# EasyEDA Pro project ProProject_nRF52840无线键盘_2024-02-15.epro, schematic Schematic1

## Sheets
1 控制: Create Date: 2023-09-05; Page Name: 控制; Project Name: 键盘成品; Schematic Name: Schematic1; Update Date: 2023-09-09; Company: 嘉立创EDA; Page Size: A4; Version: V1.0
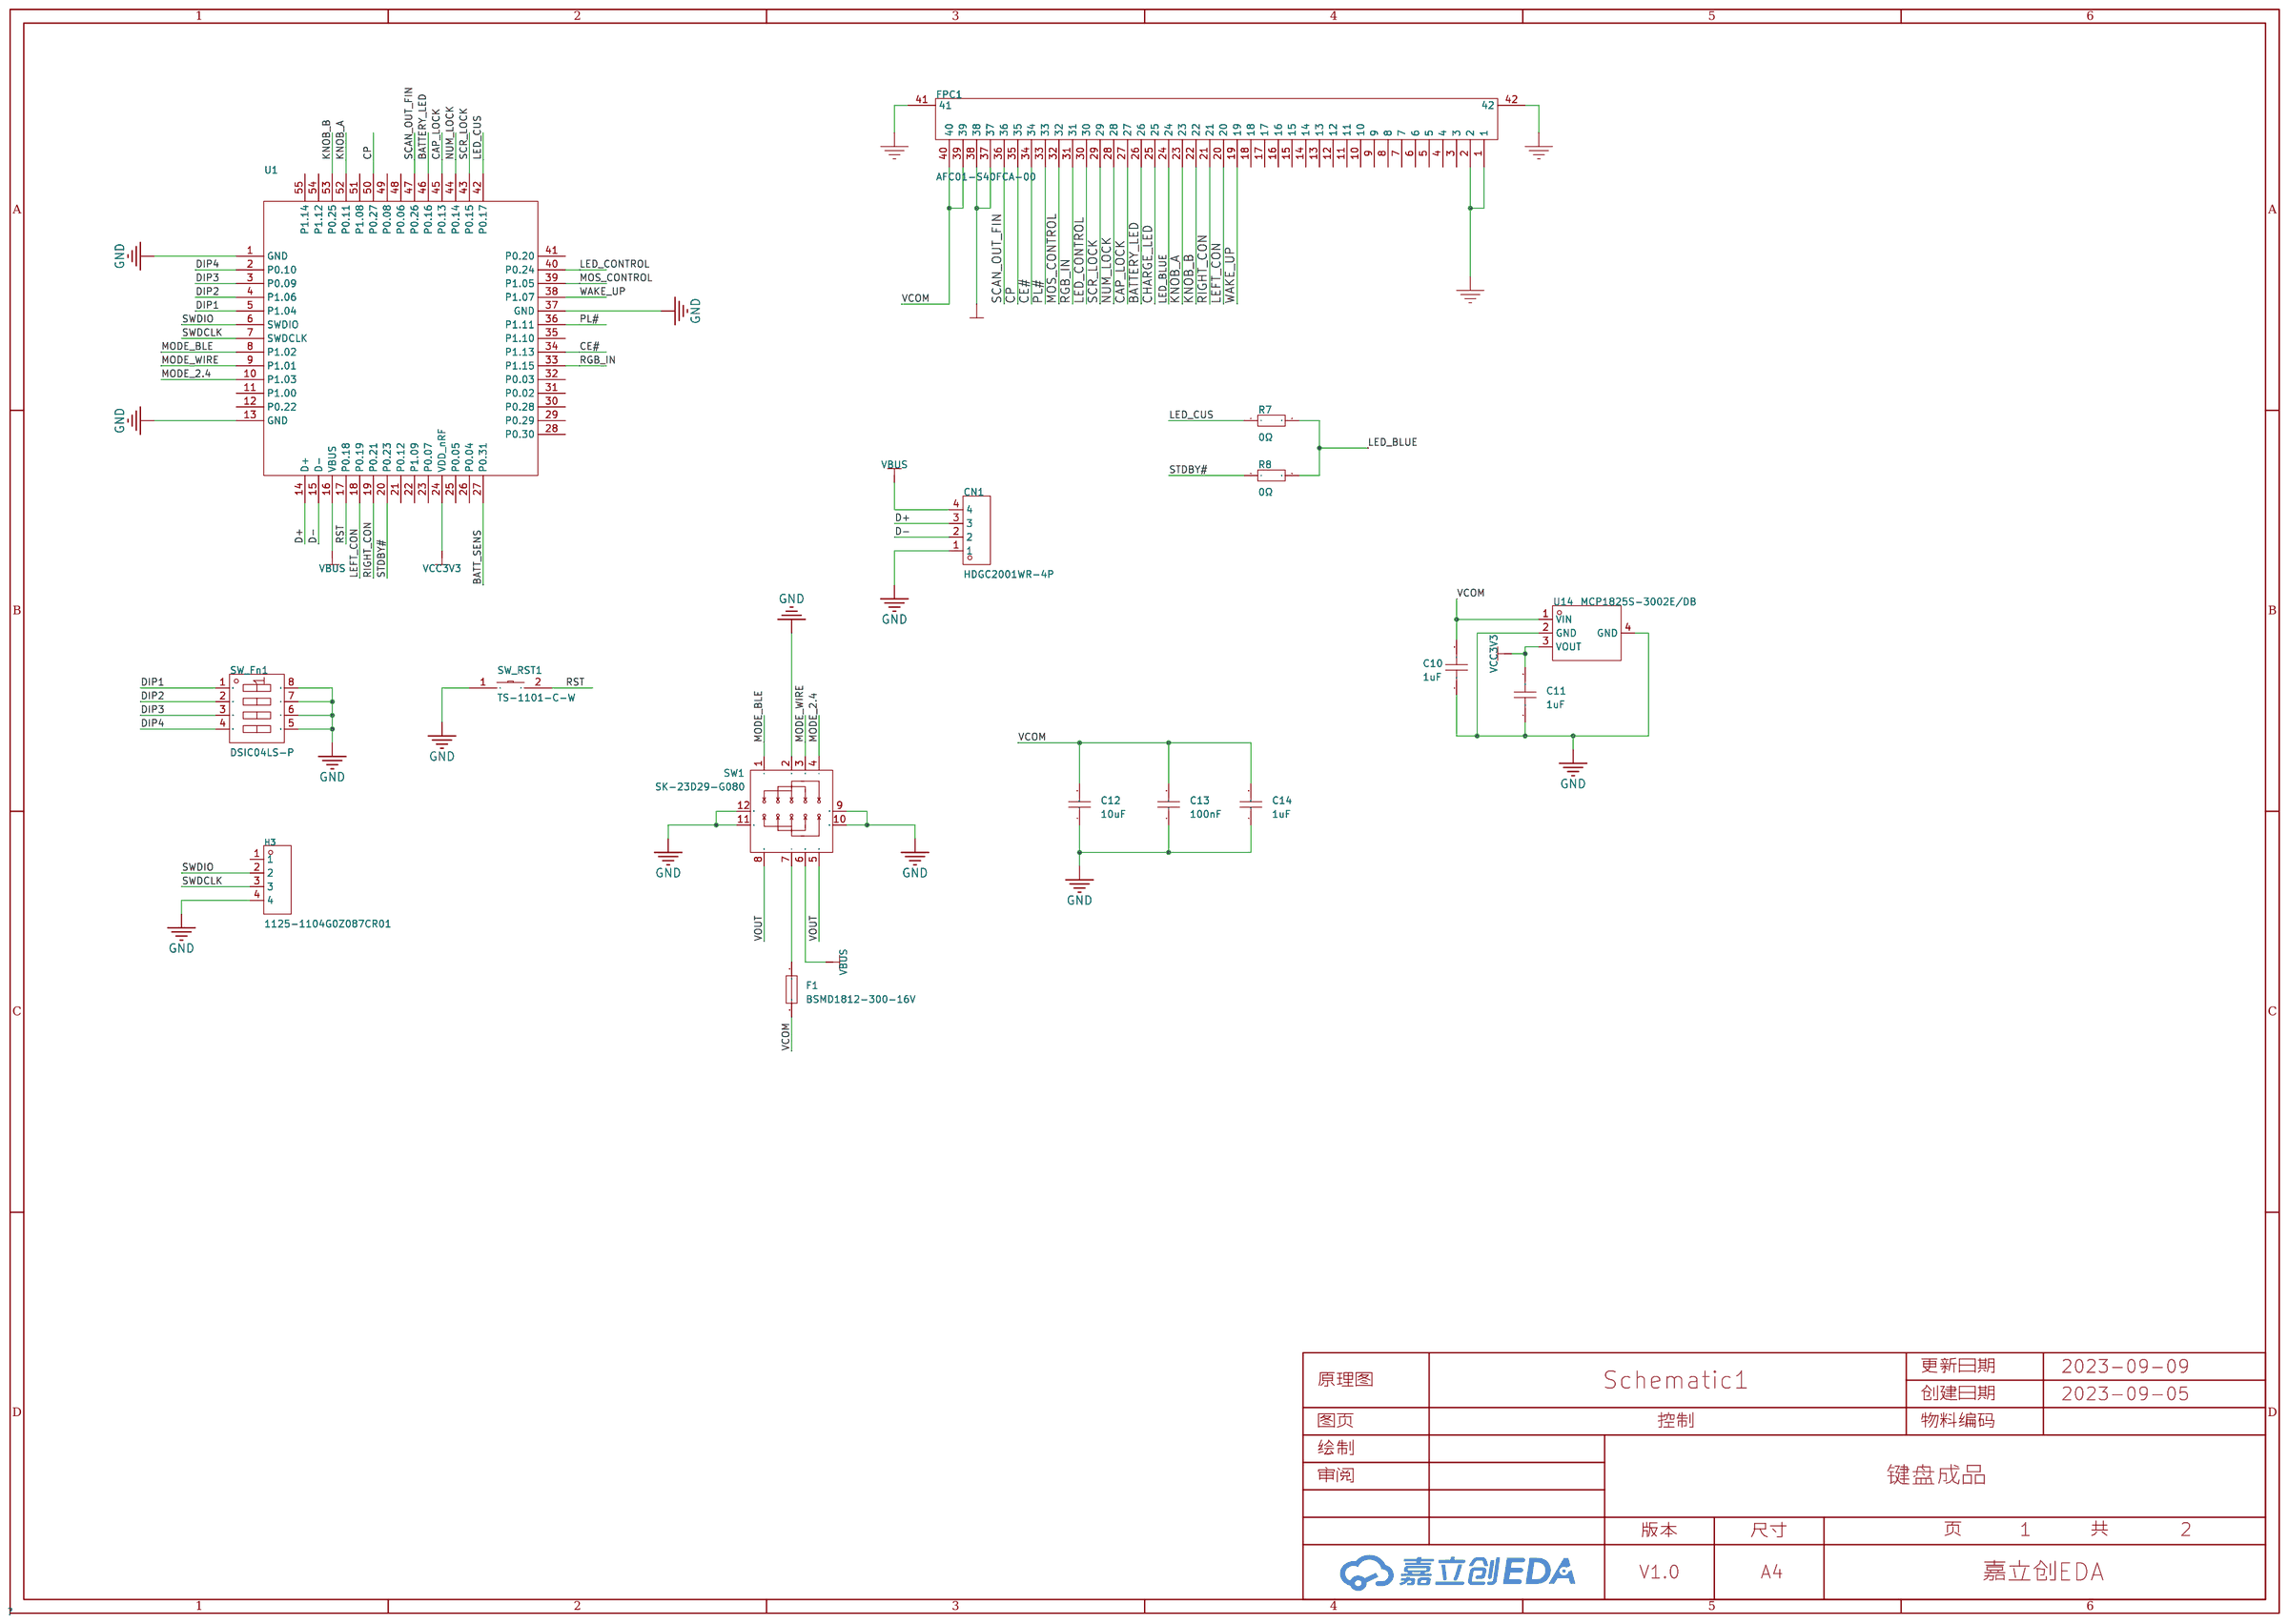
[diagram p9: 控制]
2 电源: Page Name: 电源; Update Date: 2023-09-05
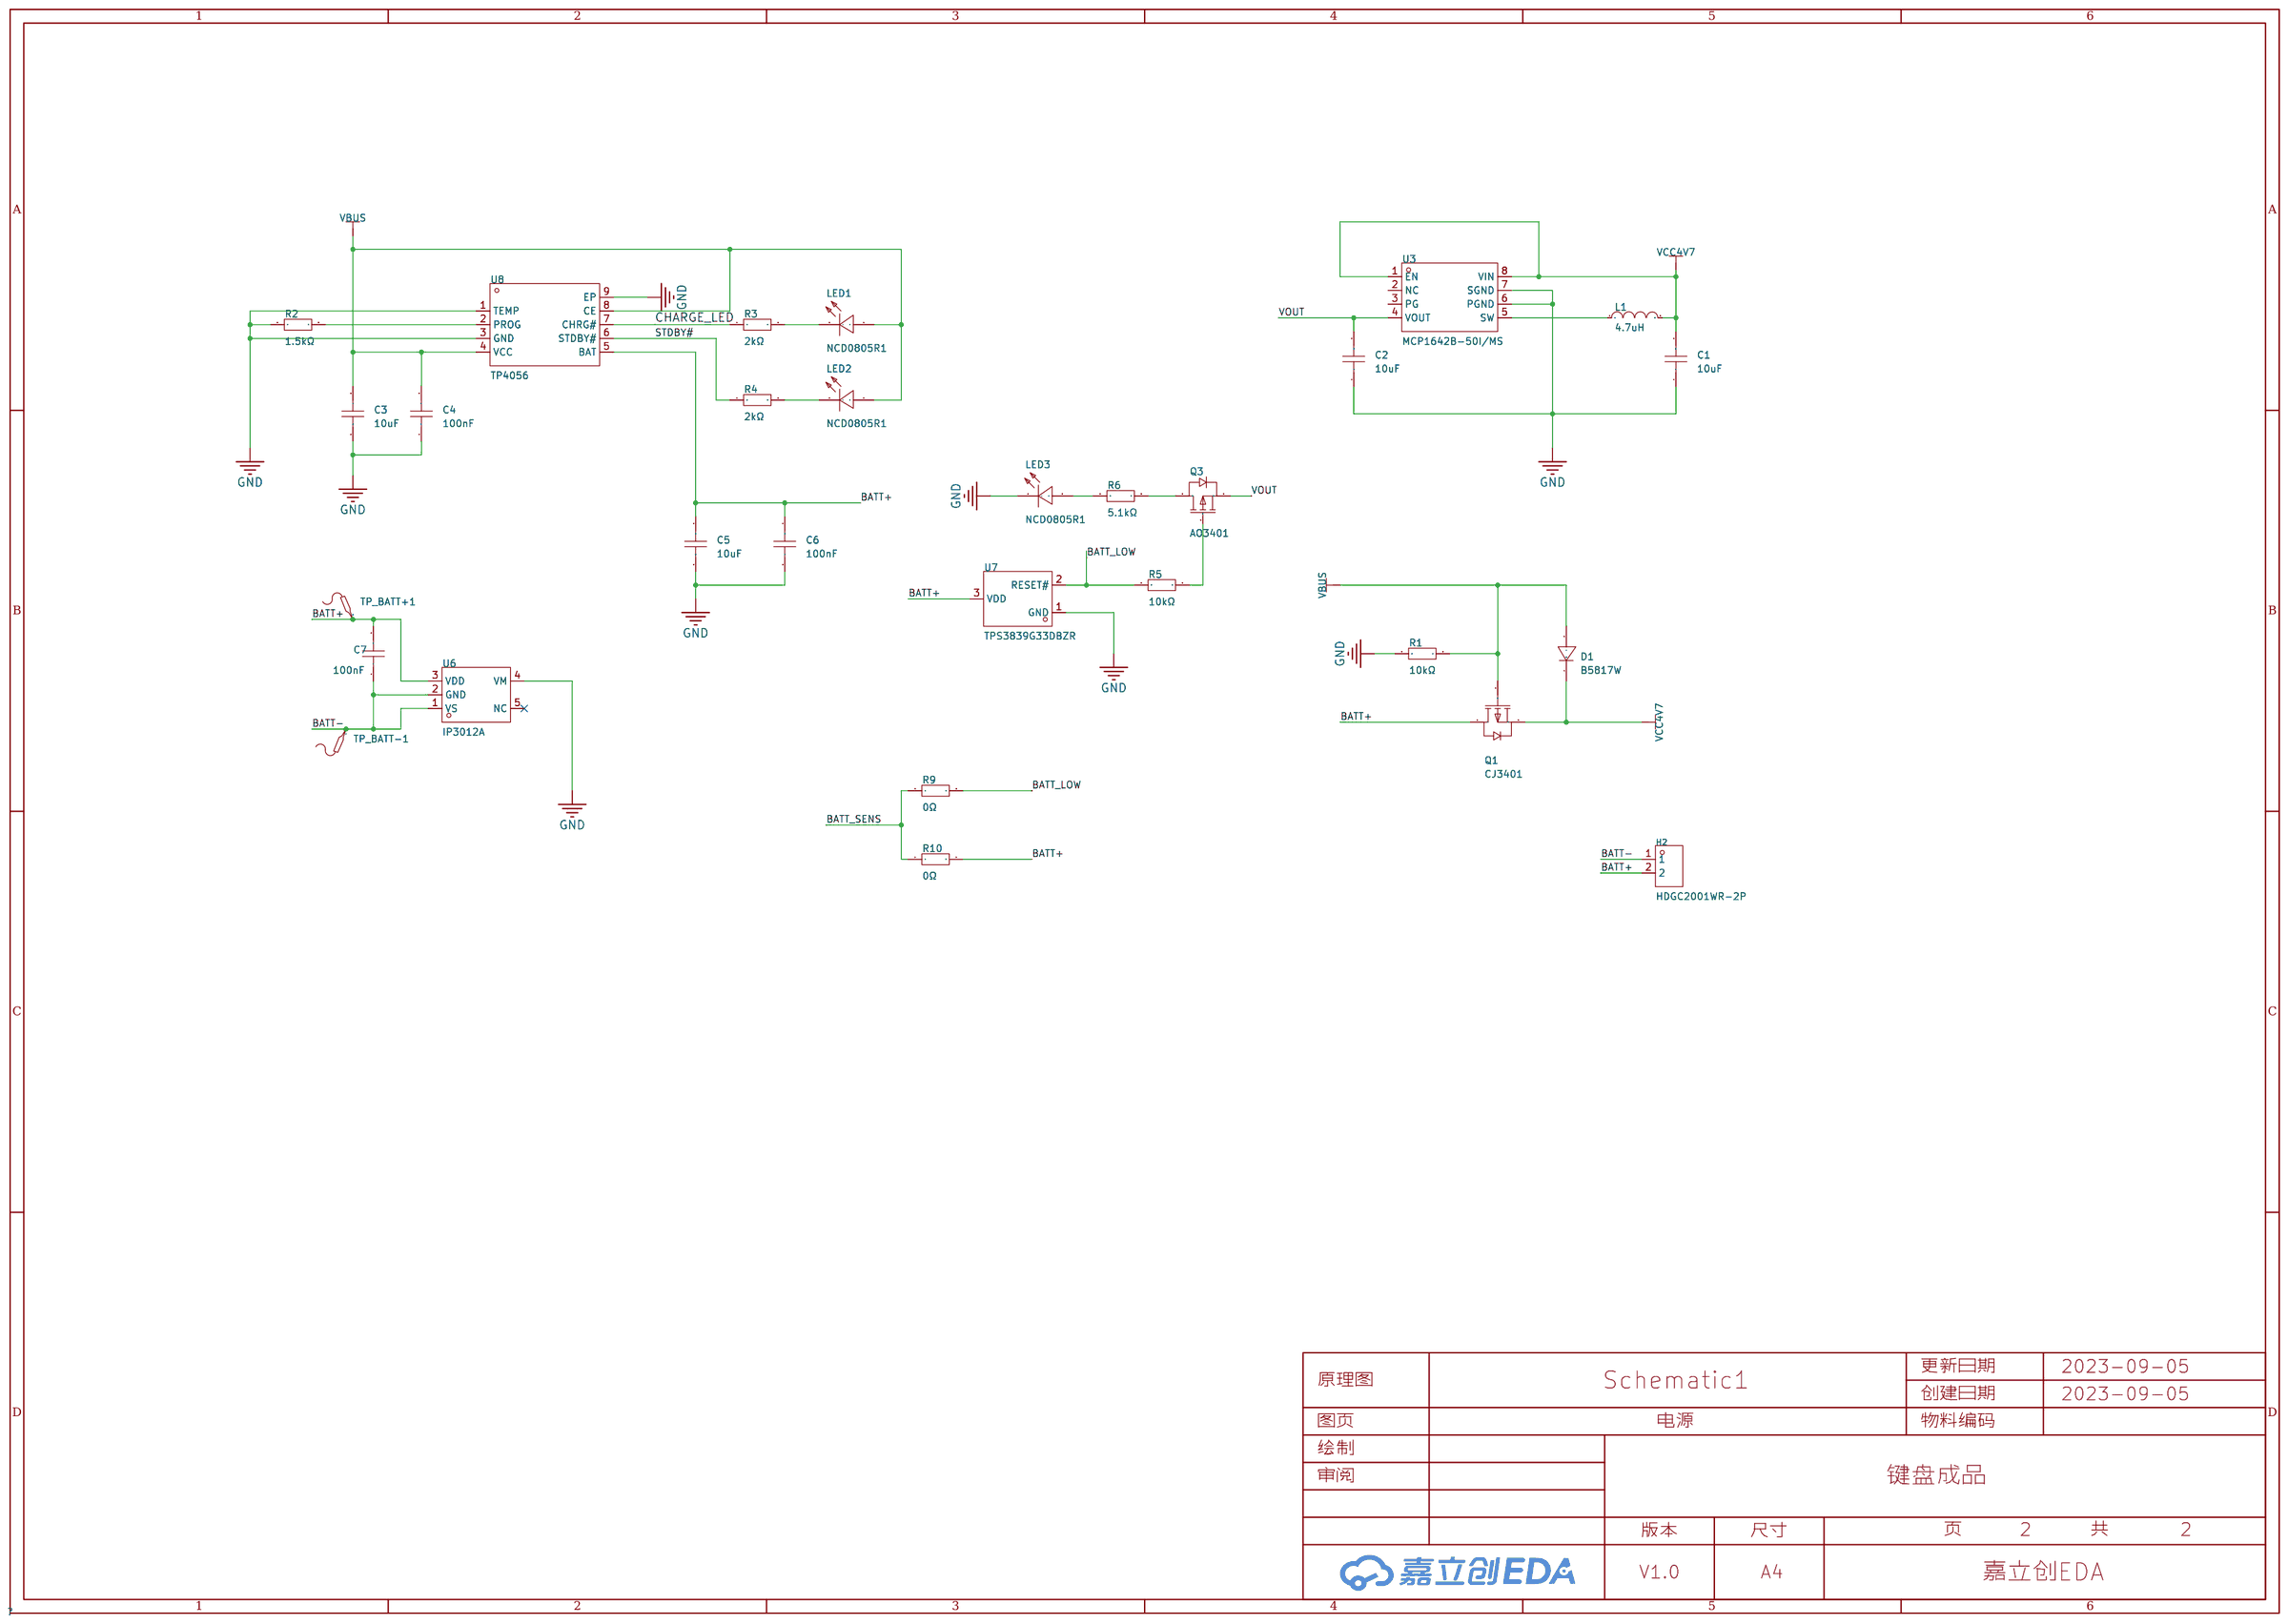
[diagram p10: 电源]

## Parts
sheet 控制
C10  1uF  [C0805]
C11  1uF  [C0805]
C12  10uF  [C0805]
C13  100nF  [C0805]
C14  1uF  [C0805]
CN1  HDGC2001WR-4P  [CONN-TH_4P-P2.00_HDGC_HDGC2001WR-4P]
F1  BSMD1812-300-16V  [F1812]
FPC1  AFC01-S40FCA-00  [FPC-SMD_P0.50-40P_FGS-XJ-H2.0]
H3  1125-1104G0Z087CR01  [CONN-SMD_1125-1104G0Z087CR01]
R7  0Ω  [R0805]
R8  0Ω  [R0805]
SW1  SK-23D29-G080  [SW-TH_G-SWITCH_SK-23D29-G080]
SW_Fn1  DSIC04LS-P  [SW-SMD_8P-L11.1-W6.2-P2.54-LS9.8]
SW_RST1  TS-1101-C-W  [SW-SMD_L6.0-W3.3-LS8.0]
U1  -  [微雪 nrf52840]
U14  MCP1825S-3002E/DB  [SOT-223-3_L6.4-W3.5-P2.30-LS7.0-BR]
sheet 电源
C1  10uF  [C0805]
C2  10uF  [C0805]
C3  10uF  [C0805]
C4  100nF  [C0805]
C5  10uF  [C0805]
C6  100nF  [C0805]
C7  100nF  [C0805]
D1  B5817W  [SOD-123_L2.8-W1.8-LS3.7-RD]
H2  HDGC2001WR-2P  [CONN-TH_2P-P2.00_HDGC2001WR-2P]
L1  4.7uH  [IND-SMD_L5.4-W5.2_FXL0530]
LED1  NCD0805R1  [LED0805-RD_RED]
LED2  NCD0805R1  [LED0805-RD_RED]
LED3  NCD0805R1  [LED0805-RD_RED]
Q1  CJ3401  [SOT-23-3_L2.9-W1.6-P1.90-LS2.8-BR]
Q3  AO3401  [SOT-23-3_L2.9-W1.4-P1.90-LS2.6-BR]
R1  10kΩ  [R0805]
R2  1.5kΩ  [R0805]
R3  2kΩ  [R0805]
R4  2kΩ  [R0805]
R5  10kΩ  [R0805]
R6  5.1kΩ  [R0805]
R9  0Ω  [R0805]
R10  0Ω  [R0805]
TP_BATT+1  -  [Test-Point-0.5mm]
TP_BATT-1  -  [Test-Point-0.5mm]
U3  MCP1642B-50I/MS  [MSOP-8_L3.0-W3.0-P0.65-LS5.0-BL]
U6  IP3012A  [SOT-23-5_L3.0-W1.7-P0.95-LS2.8-BL]
U7  TPS3839G33DBZR  [SOT-23-3_L2.9-W1.3-P1.90-LS2.4-BR]
U8  TP4056  [ESOP-8_L4.9-W3.9-P1.27-LS6.0-BL-EP]

## Library data of the parts
C10 C11 C14 = CL21B105KBFNNNE: 容值:1uF;精度:±10%;额定电压:50V;材质(温度系数):X7R;; LCSC Part Name: 1uF ±10% 50V; Supplier Part: C28323; Manufacturer: SAMSUNG(三星); Supplier Footprint: 0805; JLCPCB Part Class: Basic Part; Datasheet: https://atta.szlcsc.com/upload/public/pdf/source/20160103/1457707718219.pdf; Supplier: LCSC; Tolerance: ±10%; Voltage Rated: 50V; Temperature Coefficient: X7R
C1-C3 C5 C12 = CL21A106KAYNNNE_C15850: 容值:10uF;精度:±10%;额定电压:25V;材质(温度系数):X5R;; LCSC Part Name: 10uF ±10% 25V; Supplier Part: C15850; Manufacturer: SAMSUNG(三星); Manufacturer Part: CL21A106KAYNNNE; Supplier Footprint: 0805; JLCPCB Part Class: Basic Part; Datasheet: https://atta.szlcsc.com/upload/public/pdf/source/20160103/1457707679302.pdf; Supplier: LCSC; Tolerance: ±10%; Voltage Rated: 25V; Temperature Coefficient: X5R
C7 C13 = CC0805KRX7R9BB104: 容值:100nF;精度:±10%;额定电压:50V;材质(温度系数):X7R;; LCSC Part Name: 100nF ±10% 50V; Supplier Part: C49678; Manufacturer: YAGEO(国巨); Supplier Footprint: 0805; JLCPCB Part Class: Basic Part; Datasheet: https://atta.szlcsc.com/upload/public/pdf/source/20151026/1457707504898.pdf; Supplier: LCSC; Tolerance: ±10%; Voltage Rated: 50V; Temperature Coefficient: X7R
CN1 = HDGC2001WR-4P: LCSC Part Name: PH2.0弯针 4P; Supplier Part: C5175241; Manufacturer: HDGC(华德共创); Supplier Footprint: 弯插,P=2mm; JLCPCB Part Class: 扩展库; Datasheet: https://atta.szlcsc.com/upload/public/pdf/source/20220916/36534CA64A2134C65DEF28B604EC5CCB.pdf; Supplier: LCSC
F1 = BSMD1812-300-16V: 最大电压:16V;最大电流:40A;保持电流:3A;跳闸电流:6A;; LCSC Part Name: 16V 3A 1812自恢复 4秒内动作; Supplier Part: C883162; Manufacturer: BHFUSE(佰宏); Supplier Footprint: 1812; JLCPCB Part Class: 扩展库; Datasheet: https://atta.szlcsc.com/upload/public/pdf/source/20220302/C2BC3E2021B64191B0EAEFE91C1E6D76.pdf; Supplier: LCSC; Operating Voltage (Max): 16V; Current Rating (Max): 40A; Hold Current: 3A; Trip Current: 6A; Power Dissipation: 800mW; Resistance - Initial (Ri) (Min): 10mΩ; Resistance - Post Trip (R1) (Max): 40mΩ; Maximum Time to Trip: 4s; Operating Temperature: -40℃~+85℃
FPC1 = AFC01-S40FCA-00: 间距:0.5mm;触点数量:40;锁定特性:翻盖式;安装类型:卧贴;触点类型:下接;; LCSC Part Name: FPC 0.5MM 40P 翻盖式 H2.0mm 下接; Supplier Part: C262674; Manufacturer: JS(钜硕电子); Supplier Footprint: P=0.5mm; JLCPCB Part Class: Extended Part; Supplier: LCSC; Pitch: 0.5mm; Number of Contacts: 40; Locking Feature: 翻盖式; Mounting Type: 卧贴; Contact Type: 下接; Height Above Board: 2mm; FFC, FCB Thickness: 0.3mm~0.3mm; Design Item ID: FPC_40P; Library Name: Brian_Integrated_Lib
H3 = 1125-1104G0Z087CR01: 2.54PinHeader,1*4P,R/A&SMT,PA9TBK,W/TCAP  H=2.5,L=8.7/3.0/3.0,G/F; Supplier Part: C721861; Manufacturer: Wcon(维峰电子); Supplier Footprint: SMD; JLCPCB Part Class: Extended Part; Datasheet: https://atta.szlcsc.com/upload/public/pdf/source/20211011/347844FA63209F06732C169744A6ABAA.pdf; Supplier: LCSC; Number of Rows: 单排; Number of Pins: 4P; Pitch: 2mm; Pin Structure: 1x4P; Mounting Type: 卧贴; Circluar Pins/Square Pins: 方针; Current Rating (Max): 3A; Voltage Rating (Max): 250V; Length of Mating Pin: 4mm; Insulation Height: 2mm; Contact Material: 黄铜; Contact Plating: 金; Operating Temperature Range: -40℃~+105℃; Welding Temperature (Max): 260℃; Color: 黑色
R7-R10 = 0805W8F0000T5E: 电阻类型:厚膜电阻;阻值:0Ω;精度:±1%;功率:125mW;; LCSC Part Name: 0Ω ±1% 125mW; Supplier Part: C17477; Manufacturer: UNI-ROYAL(厚声); Supplier Footprint: 0805; JLCPCB Part Class: Basic Part; Datasheet: https://atta.szlcsc.com/upload/public/pdf/source/20200306/C422600_1E6D84923E4A46A82E41ADD87F860B5C.pdf; Supplier: LCSC; Type: 厚膜电阻; Tolerance: ±1%; Power(Watts): 125mW; Temperature Coefficient: ±800ppm/℃; Overload Voltage (Max): 150V; Operating Temperature Range: -55℃~+155℃
SW1 = SK-23D29-G080: 额定电流(DC):1A;额定电压(DC):24V;电路结构:双刀三掷;安装方式:卧插;机械寿命:1万次;开关颜色:黑色;; LCSC Part Name: 柄长8mm 卧插三档 滑动开关; Supplier Part: C2848887; Manufacturer: G-Switch(品赞); Supplier Footprint: 插件; JLCPCB Part Class: 扩展库; Datasheet: https://atta.szlcsc.com/upload/public/pdf/source/20210825/34934DF6259CE35A5F93638B4468A39B.pdf; Supplier: LCSC; Current Rating (DC): 1A; Voltage Rating (DC): 24V; Circuit: 双刀三掷; Mounting Style: 卧插; Mechanical Life: 1万次; Actuator Color: 黑色; Actuator Style: 矩形柱状; Pin Style: PC引脚; Operating Temperature: -25℃~+70℃; Switch Length: 14mm; Switch Width: 6.5mm
SW_Fn1 = DSIC04LS-P: 类型:平拨，凸起式;额定电流:25mA;额定电压:24V;电路结构:单刀单掷;开关位数:4;使用寿命:3千次;颜色:黑色;; LCSC Part Name: 2.54mm,04P贴片; Supplier Part: C319038; Manufacturer: XKB Connectivity(中国星坤); Supplier Footprint: SMD-8P,6x10.2mm; JLCPCB Part Class: 扩展库; Datasheet: https://atta.szlcsc.com/upload/public/pdf/source/20211009/004AD184124B4CBFBB0B4AFFEA8A3CC9.pdf; Supplier: LCSC; Type: 平拨，凸起式; Current Rating: 25mA; Voltage Rating: 24V; Circuit: 单刀单掷; Number of Positions: 4; Pin Style: 鸥翼型; Lead Pitch: 2.54mm; Operating Temperature: -20℃~+70℃; Operating Life: 3千次; Color: 黑色
SW_RST1 = TS-1101-C-W: 触点电流:50mA;额定电压(AC):-;额定电压(DC):12V;额定功率:-;绝缘电阻:-;电路结构:单刀单掷;安装方式:立贴;带灯:无;作用力:260gf;机械寿命:5万次;带支架:否;; LCSC Part Name: 立贴 6*3.6*2.5mm 轻触开关 一型3*6*2.5有白ZD b拉伸白色带淡绿按键 卷装; Supplier Part: C318938; Manufacturer: XKB Connectivity(中国星坤); Supplier Footprint: SMD; JLCPCB Part Class: 扩展库; Datasheet: https://atta.szlcsc.com/upload/public/pdf/source/20200227/C318938_C2E53B1EEDE37D980A33616AC086DE53.pdf; Supplier: LCSC; Contact Current: 50mA; Voltage Rating (DC): 12V; Circuit: 单刀单掷; Mounting Style: 立贴; Actuator Style: 矩形按钮; Actuator/Cap Color: 白色带淡绿; With Lamp: 无; Operating Force: 260gf; Mechanical Life: 5万次; Operating Temperature: -30℃~+85℃; Switch Length: 6mm; Switch Width: 3.6mm; Switch Height: 2.5mm; Strike Gundam: 否
U1 = 微雪 nrf52840
U14 = MCP1825S-3002E/DB: Supplier Part: C638619; Manufacturer: MICROCHIP(美国微芯); Supplier Footprint: SOT-223-3; JLCPCB Part Class: 扩展库; Supplier: LCSC
C4 C6 = 0805B104K500NT: 容值:100nF;精度:±10%;额定电压:50V;材质(温度系数):X7R;; LCSC Part Name: 100nF ±10% 50V; Supplier Part: C38141; Manufacturer: FH(风华); Supplier Footprint: 0805; JLCPCB Part Class: Extended Part; Datasheet: https://atta.szlcsc.com/upload/public/pdf/source/20170923/C38141_1506149447419988747.pdf; Supplier: LCSC; Tolerance: ±10%; Voltage Rated: 50V; Temperature Coefficient: X7R
D1 = B5817W_C8597: 直流反向耐压(Vr):20V;平均整流电流(Io):1A;正向压降(Vf):450mV@1A;; LCSC Part Name: 20V 1A 450mV@1A; Supplier Part: C8597; Manufacturer: CJ(江苏长电/长晶); Supplier Footprint: SOD-123; JLCPCB Part Class: 扩展库; Datasheet: https://atta.szlcsc.com/upload/public/pdf/source/20140809/1457707215975.pdf; Supplier: LCSC; Reverse Voltage (Vr): 20V; Average Rectified Current (Io): 1A; Forward Voltage (Vf@If): 450mV@1A
H2 = HDGC2001WR-2P: 参考系列:XH;间距:2.54mm;插针结构:1x2P;排数:1;每排PIN数:2;行距:-;公母:公型插针;安装方式:弯插;额定电流:3A;工作温度范围:-25℃~+85℃;; LCSC Part Name: PH2.0弯针 2P; Supplier Part: C5175239; Manufacturer: HDGC(华德共创); Supplier Footprint: 弯插,P=2mm; JLCPCB Part Class: Extended Part; Datasheet: https://atta.szlcsc.com/upload/public/pdf/source/20220916/36534CA64A2134C65DEF28B604EC5CCB.pdf; Supplier: LCSC; Reference Series: XH; Pitch: 2.54mm; Pins Structure: 1x2P; Number of Rows: 1; Number of PINs Per Row: 2; Gender: 公型插针; Mounting Style: 弯插; Current Rating (Max): 3A; Operating Temperature Range: -25℃~+85℃; Number of Pins: 2P; Pin Structure: 1x2P; Mounting Type: 直插; Circluar Pins/Square Pins: 方针; Length of Mating Pin: 6mm; Insulation Height: 2.5mm; Length of End Connection Pin: 3mm; Contact Material: 黄铜; Color: 黑色
L1 = FXL0530-4R7-M: 电感值:4.7uH;精度:±20%;额定电流:4.5A;饱和电流(Isat):5A;; LCSC Part Name: 4.7uH ±20% 4.5A 50mΩ; Supplier Part: C177246; Manufacturer: cjiang(长江微电); Supplier Footprint: SMD,5.2x5.4mm; JLCPCB Part Class: Extended Part; Datasheet: https://atta.szlcsc.com/upload/public/pdf/source/20190322/C177246_D81D0671B72FD9DE4B58607F480A6AE0.pdf; Supplier: LCSC; Tolerance: ±20%; Rated Current: 4.5A; Saturation Current (Isat): 5A; DC Resistance (DCR): 50mΩ
LED1-LED3 = NCD0805R1: 发光颜色:红灯;; LCSC Part Name: 红灯; Supplier Part: C84256; Manufacturer: 国星光电; Supplier Footprint: 0805; JLCPCB Part Class: 基础库; Datasheet: https://atta.szlcsc.com/upload/public/pdf/source/20200820/C84256_F0A75A43B3EAD75808600A0514C76B99.pdf; Supplier: LCSC; Emitted Color: 红灯
Q1 = CJ3401: 类型:P沟道;漏源电压(Vdss):30V;连续漏极电流(Id):4.2A;功率(Pd):350mW;导通电阻(RDS(on)@Vgs,Id):65mΩ@10V,4.2A;; LCSC Part Name: P沟道 30V 4.2A; Supplier Part: C13799; Manufacturer: CJ(江苏长电/长晶); Supplier Footprint: SOT-23; JLCPCB Part Class: 扩展库; Datasheet: https://atta.szlcsc.com/upload/public/pdf/source/20140815/1457707217656.pdf; Supplier: LCSC; Type: P沟道; Drain Source Voltage (Vdss): 30V; Continuous Drain Current (Id): 4.2A; Power Dissipation (Pd): 350mW; Drain Source On Resistance (RDS(on)@Vgs,Id): 65mΩ@10V,4.2A; Gate Threshold Voltage (Vgs(th)@Id): 1.3V@250uA
Q3 = AO3401_C727156: 类型:P沟道;漏源电压(Vdss):30V;连续漏极电流(Id):4.2A;功率(Pd):350mW;导通电阻(RDS(on)@Vgs,Id):65mΩ@10V,4.2A;; LCSC Part Name: P沟道 30V 4.2A; Supplier Part: C727156; Manufacturer: TWGMC(台湾迪嘉); Supplier Footprint: SOT-23; JLCPCB Part Class: 扩展库; Datasheet: https://atta.szlcsc.com/upload/public/pdf/source/20200827/C727156_6E081BBEEFBC6B8FEE164CB196B0AF30.pdf; Supplier: LCSC; Type: P沟道; Drain Source Voltage (Vdss): 30V; Continuous Drain Current (Id): 4.2A; Power Dissipation (Pd): 350mW; Drain Source On Resistance (RDS(on)@Vgs,Id): 65mΩ@10V,4.2A; Gate Threshold Voltage (Vgs(th)@Id): 1.3V@250uA
R1 R5 = 0805W8F1002T5E_C17414: 电阻类型:厚膜电阻;阻值:10kΩ;精度:±1%;功率:125mW;; LCSC Part Name: 10kΩ ±1% 125mW; Supplier Part: C17414; Manufacturer: UNI-ROYAL(厚声); Manufacturer Part: 0805W8F1002T5E; Supplier Footprint: 0805; JLCPCB Part Class: Basic Part; Datasheet: https://atta.szlcsc.com/upload/public/pdf/source/20200306/C422600_1E6D84923E4A46A82E41ADD87F860B5C.pdf; Supplier: LCSC; Type: 厚膜电阻; Tolerance: ±1%; Power(Watts): 125mW; Temperature Coefficient: ±100ppm/℃; Overload Voltage (Max): 150V; Operating Temperature Range: -55℃~+155℃
R2 = 0805W8F1501T5E: 电阻类型:厚膜电阻;阻值:1.5kΩ;精度:±1%;功率:125mW;; LCSC Part Name: 1.5kΩ ±1% 125mW; Supplier Part: C4310; Manufacturer: UNI-ROYAL(厚声); Supplier Footprint: 0805; JLCPCB Part Class: Basic Part; Datasheet: https://atta.szlcsc.com/upload/public/pdf/source/20200306/C422600_1E6D84923E4A46A82E41ADD87F860B5C.pdf; Supplier: LCSC; Type: 厚膜电阻; Tolerance: ±1%; Power(Watts): 125mW; Temperature Coefficient: ±100ppm/℃; Overload Voltage (Max): 150V; Operating Temperature Range: -55℃~+155℃
R3 R4 = RS-05K2001FT: 阻值:2kΩ;精度:±1%;功率:125mW;; LCSC Part Name: 2kΩ ±1% 125mW; Supplier Part: C132365; Manufacturer: FH(风华); Supplier Footprint: 0805; JLCPCB Part Class: Extended Part; Datasheet: https://atta.szlcsc.com/upload/public/pdf/source/20170925/C132365_1506321687709990480.pdf; Supplier: LCSC; Tolerance: ±1%; Power(Watts): 125mW; Temperature Coefficient: ±100ppm/℃; Overload Voltage (Max): 150V; Operating Temperature Range: -55℃~+155℃
R6 = 0805W8F5101T5E: 电阻类型:厚膜电阻;阻值:5.1kΩ;精度:±1%;功率:125mW;; LCSC Part Name: 5.1kΩ ±1% 125mW; Supplier Part: C27834; Manufacturer: UNI-ROYAL(厚声); Supplier Footprint: 0805; JLCPCB Part Class: Basic Part; Datasheet: https://atta.szlcsc.com/upload/public/pdf/source/20200306/C422600_1E6D84923E4A46A82E41ADD87F860B5C.pdf; Supplier: LCSC; Type: 厚膜电阻; Tolerance: ±1%; Power(Watts): 125mW; Temperature Coefficient: ±100ppm/℃; Overload Voltage (Max): 150V; Operating Temperature Range: -55℃~+155℃
TP_BATT+1 TP_BATT-1 = Test-Point: Test Point 测试点
U3 = MCP1642B-50I/MS: 功能类型:升压型;输出类型:固定;输入电压:650mV~5.5V;输出电压:5V;输出电流(最大值):800mA;; LCSC Part Name: 升压型 输入650mV~5.5V 输出5V 800mA; Supplier Part: C635908; Manufacturer: MICROCHIP(美国微芯); Supplier Footprint: MSOP-8; JLCPCB Part Class: 扩展库; Datasheet: https://atta.szlcsc.com/upload/public/pdf/source/20171228/C153267_15144475686741215020.pdf; Supplier: LCSC; Function: 升压型; Synchronous Rectification: 是; Output Type: 固定; Number of Outputs: 1; Topology: 升压式; Input Voltage: 650mV~5.5V; Output Voltage: 5V; Output Current (Max): 800mA; Switching Frequency: 1MHz; Operating Temperature: -40℃~+85℃@(TA)
U6 = IP3012A: LCSC Part Name: 锂电保护; Supplier Part: C605435; Manufacturer: INJOINIC(英集芯); Supplier Footprint: SOT-23-5L; JLCPCB Part Class: 扩展库; Datasheet: https://atta.szlcsc.com/upload/public/pdf/source/20200610/C605435_EA0C00A0C2FC06334AFCEDB0E6B07573.pdf; Supplier: LCSC
U7 = TPS3839G33DBZR: TPS3839 超低功耗、电源电压监测器; Supplier Part: C485802; Manufacturer: TI(德州仪器); Supplier Footprint: SOT-23-3; JLCPCB Part Class: 扩展库; Datasheet: https://atta.szlcsc.com/upload/public/pdf/source/20200118/C485802_AE4EDCC9CF2A2FA42FC9C2C53F4AA092.pdf; Supplier: LCSC
U8 = TP4056_C725790: Supplier Part: C725790; Manufacturer: UMW(友台半导体); Supplier Footprint: ESOP-8; JLCPCB Part Class: 扩展库; Datasheet: https://atta.szlcsc.com/upload/public/pdf/source/20211011/37515E71BA298E23D23475482C49633D.pdf; Supplier: LCSC

## Nets
GND: C1.1 C2.1 C3.1 C4.1 C5.2 C6.2 C10.1 C11.1 C12.1 C13.1 C14.1 CN1.1 FPC1.1 FPC1.2 FPC1.41 FPC1.42 H3.4 LED3.1(-) R1.1 R2.1 SW1.2 SW1.9 SW1.10 SW1.11 SW1.12 SW_Fn1.5(PIN5) SW_Fn1.6(PIN6) SW_Fn1.7(PIN7) SW_Fn1.8(PIN8) SW_RST1.1 U1.1(GND) U1.13(GND) U1.37(GND) U3.6(PGND) U3.7(SGND) U6.4(VM) U7.1(GND) U8.1(TEMP) U8.3(GND) U8.9(EP) U14.2(GND) U14.4(GND)
VBUS: C3.2 C4.2 CN1.4 D1.2(A) LED1.2(+) LED2.2(+) Q1.1(G) R1.2 SW1.6 U1.16(VBUS) U8.4(VCC) U8.8(CE)
VCC3V3: C11.2 FPC1.37 FPC1.38 U1.24(VDD_nRF) U14.3(VOUT)
VCC4V7: C1.2 D1.1(C) L1.2 Q1.2(S) U3.1(EN) U3.8(VIN)
BATT+: C5.1 C6.1 C7.2 H2.2 Q1.3(D) R10.2 TP_BATT+1.1 U6.3(VDD) U7.3(VDD) U8.5(BAT)
BATT-: C7.1 H2.1 TP_BATT-1.1 U6.1(VS) U6.2(GND)
BATT_LOW: R5.1 R9.2 U7.2(RESET#)
BATT_SENS: R9.1 R10.1 U1.27(P0.31)
BATTERY_LED: FPC1.26 U1.46(P0.16)
CAP_LOCK: FPC1.27 U1.45(P0.13)
CE#: FPC1.34 U1.34(P1.13)
CHARGE_LED: FPC1.25 R3.1 U8.7(CHRG#)
CP: FPC1.35 U1.50(P0.27)
D+: CN1.3 U1.14(D+)
D-: CN1.2 U1.15(D-)
DIP1: SW_Fn1.1(PIN1) U1.5(P1.04)
DIP2: SW_Fn1.2(PIN2) U1.4(P1.06)
DIP3: SW_Fn1.3(PIN3) U1.3(P0.09)
DIP4: SW_Fn1.4(PIN4) U1.2(P0.10)
KNOB_A: FPC1.23 U1.52(P0.11)
KNOB_B: FPC1.22 U1.53(P0.25)
LED_BLUE: FPC1.24 R7.2 R8.2
LED_CONTROL: FPC1.30 U1.40(P0.24)
LED_CUS: R7.1 U1.42(P0.17)
LEFT_CON: FPC1.20 U1.18(P0.19)
MODE_2.4: SW1.4 U1.10(P1.03)
MODE_BLE: SW1.1 U1.8(P1.02)
MODE_WIRE: SW1.3 U1.9(P1.01)
MOS_CONTROL: FPC1.32 U1.39(P1.05)
NUM_LOCK: FPC1.28 U1.44(P0.14)
PL#: FPC1.33 U1.36(P1.11)
RGB_IN: FPC1.31 U1.33(P1.15)
RIGHT_CON: FPC1.21 U1.19(P0.21)
RST: SW_RST1.2 U1.17(P0.18)
SCAN_OUT_FIN: FPC1.36 U1.47(P0.26)
SCR_LOCK: FPC1.29 U1.43(P0.15)
STDBY#: R4.1 R8.1 U1.20(P0.23) U8.6(STDBY#)
SWDCLK: H3.3 U1.7(SWDCLK)
SWDIO: H3.2 U1.6(SWDIO)
VCOM: C10.2 C12.2 C13.2 C14.2 F1.1 FPC1.39 FPC1.40 U14.1(VIN)
VOUT: C2.2 Q3.2(S) SW1.5 SW1.8 U3.4(VOUT)
WAKE_UP: FPC1.19 U1.38(P1.07)
$1N2725: F1.2 SW1.7
$2N1962: L1.1 U3.5(SW)
$2N1974: R2.2 U8.2(PROG)
$2N1979: LED1.1(-) R3.2
$2N1981: LED2.1(-) R4.2
$2N2010: LED3.2(+) R6.1
$2N2012: Q3.3(D) R6.2
$2N2217: Q3.1(G) R5.2

Not connected (* = marked no-connect by the designer): FPC1 3 4 5 6 7 8 9 10 11 12 13 14 15 16 17 18; H3 1; U1 11(P1.00) 12(P0.22) 21(P0.12) 22(P1.09) 23(P0.07) 25(P0.05) 26(P0.04) 28(P0.30) 29(P0.29) 30(P0.28) 31(P0.02) 32(P0.03) 35(P1.10) 41(P0.20) 48(P0.06) 49(P0.08) 51(P1.08) 54(P1.12) 55(P1.14); U3 2(NC) 3(PG); U6 5(NC)*
